# Altium schematic sheet TTAmp_3T0K_power.SchDoc
size A4; ApprovedBy: Krzysztof Belewicz; CheckedBy: Krzysztof Belewicz; Author: Krzysztof Belewicz; CompanyName: Koło Naukowe Systemów Scalonych; DrawnBy: Krzysztof Belewicz; Organization: KNSS; Address1: Koło Naukowe; Address2: Systemów Scalonych; Address3: 00-665 Warszawa; Address4: Nowowiejska 15/19; Revision: 0.1; SheetNumber: 1; SheetTotal: 5
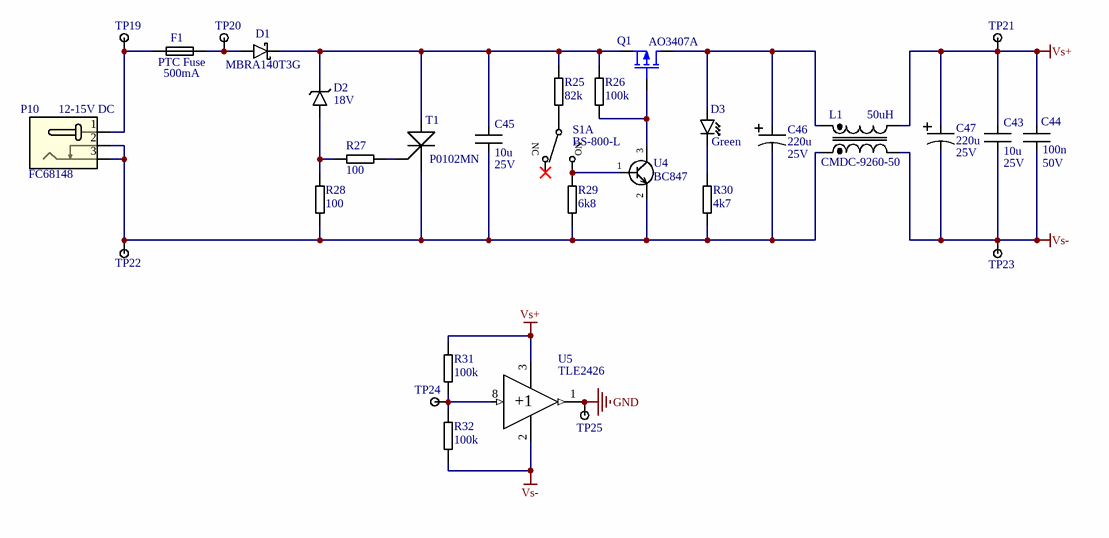
[diagram p0: TTAmp_3T0K_power.SchDoc]

## Parts
C43  value 10u  MaxVoltage: 25V  [CAPC2012N]  (hidden comment: Capacitor)
C44  value 100n  MaxVoltage: 50V  [CAPC1608N]  (hidden comment: Capacitor)
C45  value 10u  MaxVoltage: 25V  [CAPC2012N]  (hidden comment: Capacitor)
C46  value 220u  MaxVoltage: 25V  [8x10]  (hidden comment: SC1E227M08010VR)
C47  value 220u  MaxVoltage: 25V  [8x10]  (hidden comment: SC1E227M08010VR)
D1  MBRA140T3G  [SMA]
D2  value 18V  [SOD123]  (hidden comment: Zener Diode)
D3  Green  [LED_0603_GREEN]
F1  PTC Fuse  value 500mA  [RESC4532N]
L1  CMDC-9260-50  value 50uH  [CMDC-09260 HF]
P10  12-15V DC  [FC681478]
Q1  AO3407A  [SOT23-3N]
R25  value 82k  [RESC1608N]  (hidden comment: Resistor)
R26  value 100k  [RESC1608N]  (hidden comment: Resistor)
R27  value 100  [RESC1608N]  (hidden comment: Resistor)
R28  value 100  [RESC1608N]  (hidden comment: Resistor)
R29  value 6k8  [RESC1608N]  (hidden comment: Resistor)
R30  value 4k7  [RESC1608N]  (hidden comment: Resistor)
R31  value 100k  [RESC1608N]  (hidden comment: Resistor)
R32  value 100k  [RESC1608N]  (hidden comment: Resistor)
S1  BS-800-L  [BS-800-L]  (part A of 2)
T1  P0102MN  [SOT223_N]
TP19  (no value)  [TP-SMD-1.0MM]  (no BOM)
TP20  (no value)  [TP-SMD-1.0MM]  (no BOM)
TP21  (no value)  [TP-SMD-1.0MM]  (no BOM)
TP22  (no value)  [TP-SMD-1.0MM]  (no BOM)
TP23  (no value)  [TP-SMD-1.0MM]  (no BOM)
TP24  (no value)  [TP-SMD-1.0MM]  (no BOM)
TP25  (no value)  [TP-SMD-1.0MM]  (no BOM)
U4  BC847  [SOT323_L]
U5  TLE2426  [SOIC8]

## Nets
GND: TP25.1 U5.1(OUT)
Vs+: C43.2 C44.2 C47.1 L1.4 R31.2 TP21.1 U5.3(IN)
Vs-: C43.1 C44.1 C47.2 L1.3 R32.1 TP23.1 U5.2(COMMON)
NetC45_1: C45.1 C46.2 L1.2 P10.2 P10.3 R28.1 R29.1 R30.1 T1.1(K) TP22.1 U4.2(E)
NetC45_2: C45.2 D1.2 D2.2 Q1.2(S) R25.2 R26.2 T1.2(A)
NetC46_1: C46.1 D3.A L1.1 Q1.3(D)
NetD1_1: D1.1 F1.2 TP20.1
NetD2_1: D2.1 R27.2 R28.2
NetD3_K: D3.K R30.2
NetF1_1: F1.1 P10.1 TP19.1
NetQ1_1: Q1.1(G) R26.1 U4.3(C)
NetR25_1: R25.1 S1.2(COM_1)
NetR27_1: R27.1 T1.3(G)
NetR29_2: R29.2 S1.3(NO_1) U4.1(B)
NetR31_1: R31.1 R32.2 TP24.1 U5.8(NOISE_REDUCTION)

Not connected (* = marked no-connect by the designer): S1 1(NC_1)*

## Notes on the sheet
- Project:
- Variant:
- File:
- Sheet:
- Revision:
- Total Sheet:
- Author:
- Modified:
- (in symbol BS-800-L, part A) NC; NO
- (in symbol TLE2426) +1

## Library data of the parts
C43-C45 = Capacitor: Tolerance: 10%; Supplier 1: TME; Supplier 2: *
  C43 C45: Supplier Part Number 1: GRM21BR61E106KA73L
  C44: Supplier Part Number 1: CL10B104KB8NNNC
C46 C47 = Capacitor Polarized: Manufacturer 1: SAMWHA; Tolerance: 20%; Supplier 1: TME; Supplier Part Number 1: SC1E227M08010VR; Manufacturer Part Number 1: SC1E227M08010VR
D1 = MBRA140T3G: Dioda: prostownicza Schottky; SMD; 40V; 1A; SMA; pin to pad: 1>A 2>K; Manufacturer 1: ON SEMICONDUCTOR; Supplier 1: TME; Supplier Part Number 1: MBRA140T3G; Manufacturer Part Number 1: MBRA140T3G
D2 = MMSZ5227BT1G: Zener Diode 18V 0.5W smd SOD123; Manufacturer 1: ON SEMICONDUCTOR; Manufacturer Part Number 1: MMSZ18T1G; Supplier 1: TME; Supplier Part Number 1: MMSZ18T1G
D3 = LED_SMD_0603: LED 0603; Manufacturer 1: OPTOSUPPLY; Manufacturer Part Number 1: OSG80603C1E; Voltage: 1.6-2.4V; MaxCurrent: 5mA; Supplier 1: TME; Supplier Part Number 1: OSG80603C1E; Color: Green
F1 = SD075-16: PTC Fuse 750mA; Manufacturer 1: ECE; Manufacturer Part Number 1: SD050-16; Max Voltage: 16V; Supplier 1: TME; Supplier Part Number 1: SD075-16; Supplier 2: *; Supplier Part Number 2: *; Stand Current: 500mA
L1 = CMDC-9260-50: Dławik: common mode; SMD; 800mA; 320mΩ; Ind.poj.uzw:50uH; Il.uzw:2; Manufacturer 1: FERROCORE; Max Voltage: 80VDC; Resistance: 320mOhm; Manufacturer Part Number 1: CMDC-9260-50; Supplier 1: TME; Supplier Part Number 1: CMDC-9260-50; Max Current: 800mA
P10 = FC68148: Socket; Barrel jack DC; male; 5,5/2,1mm; THT; Manufacturer Part Number 1: DC-10A FC68148; Manufacturer 1: Cliff; Max Voltage: 12VDC; Max Current: 5A; Supplier 1: TME; Supplier Part Number 1: FC68148
Q1 = MOSFET-P: P-Channel MOSFET; Manufacturer 1: ALPHA & OMEGA SEMICONDUCTOR; Supplier Part Number 1: AO3407A; Supplier 1: TME; Manufacturer Part Number 1: AO3407A
R25 = Resistor: Manufacturer 1: WALSIN; Manufacturer Part Number 1: WF06P823JTL; Tolerance: 5%; Power: 0.125W; Supplier 1: TME; Supplier Part Number 1: WF06P-82K-5%
R26 R31 R32 = Resistor: Manufacturer 1: ROYAL OHM; Manufacturer Part Number 1: HP03W5J0104T5E; Tolerance: 5%; Power: 0.2W; Supplier 1: TME; Supplier Part Number 1: HP03-100K5%
R27 = Resistor: Manufacturer 1: WALSIN; Manufacturer Part Number 1: WF06P101JTL; Tolerance: 5%; Power: 0.125W; Supplier 1: TME; Supplier Part Number 1: WF06P-100R-5%
R28 = Resistor: Manufacturer Part Number 1: WF06P101JTL; Manufacturer 1: WALSIN; Tolerance: 5%; Power: 0.125W; Supplier 1: TME; Supplier Part Number 1: WF06P-100R-5%
R29 = Resistor: Manufacturer Part Number 1: RC0603JR-076K8L; Manufacturer 1: YAGEO; Tolerance: 5%; Power: 0.1W; Supplier 1: TME; Supplier Part Number 1: RC0603JR-076K8
R30 = Resistor: Manufacturer Part Number 1: WF06P472JTL; Manufacturer 1: WALSIN; Tolerance: 5%; Power: 0.125W; Supplier 1: TME; Supplier Part Number 1: WF06P-4K7-5%
S1 = BS-800-L: Manufacturer 1: CANAL ELECTRONIC; Max Current: 0.1A; Max Voltage: 30VDC; Manufacturer Part Number 1: BS-800-L; Supplier Part Number 1: BS800L; Supplier 1: TME
T1 = P0102MN 5AA4: Manufacturer 1: ST MICROELECTRONICS; Manufacturer Part Number 1: P0102MN 5AA4; Supplier 1: TME; Supplier Part Number 1: P0102MN-5AA4
TP19-TP25 = TP1: Test Point for probe
U4 = BC847AW.115: Tranzystor: NPN; bipolarny; 45V; 200mA; 200mW; SOT323; Manufacturer 1: NEXPERIA; Manufacturer Part Number 1: BC847AW.115; Supplier 1: TME; Supplier Part Number 1: BC847AW.115
U5 = TLE2426: Texas Instrument Low-Noise JFET-Input Operational Amplifier; Manufacturer 1: TEXAS INSTRUMENTS; Manufacturer Part Number 1: TLE2426ID; Supplier 1: Farnell; Supplier Part Number 1: 8454833